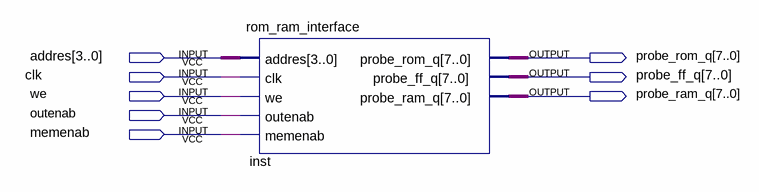
[diagram p0: schematic sheet]
// Quartus schematic lab3_var7_v1.bdf as structural Verilog: 1 symbols, 8 pins
module lab3_var7_v1 (
  input  [3:0] addres,
  input  clk,
  input  we,
  input  outenab,
  input  memenab,
  output [7:0] probe_rom_q,
  output [7:0] probe_ff_q,
  output [7:0] probe_ram_q
);

  rom_ram_interface inst (
    .addres(addres), .clk(clk), .we(we), .outenab(outenab), .memenab(memenab), .probe_rom_q(probe_rom_q),
    .probe_ff_q(probe_ff_q), .probe_ram_q(probe_ram_q));
endmodule
